# Altium schematic sheet Sheet1.schdoc
size A2; SheetNumber: 8; SheetTotal: 8
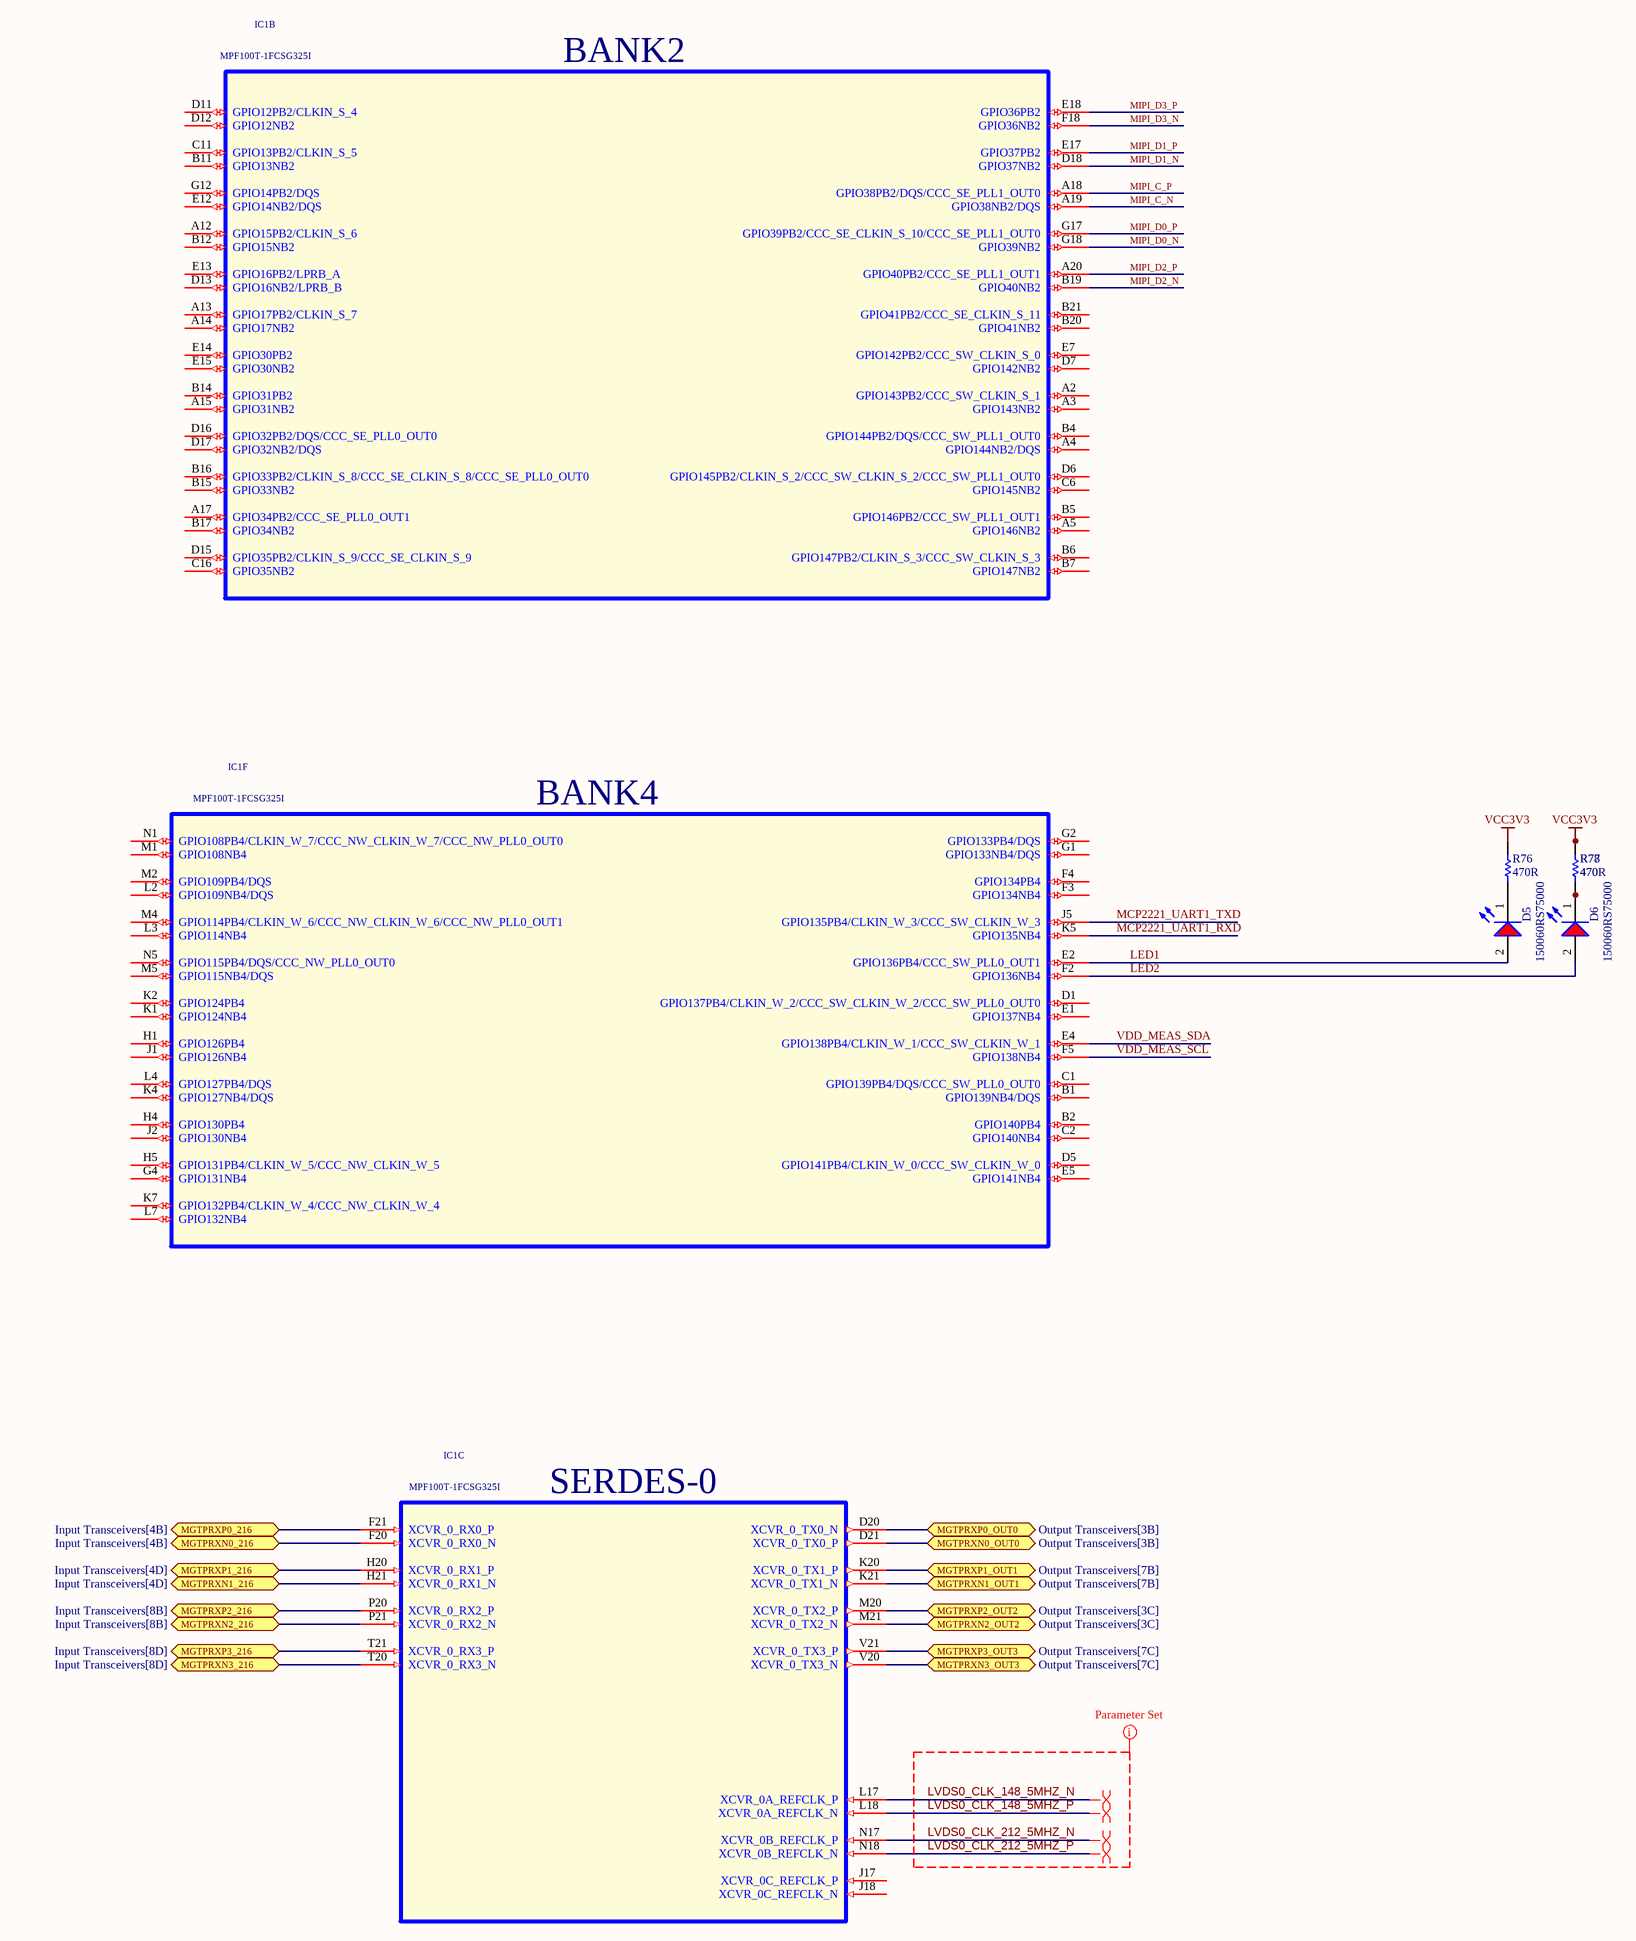
[diagram p0: Sheet1.schdoc]

## Parts
D5  150060RS75000  [WL-SMCW_0603_150060xx75000]
D6  150060RS75000  [WL-SMCW_0603_150060xx75000]
IC1  MPF100T-1FCSG325I  [MPF100T-1FCSG325I]  (parts B,C,F of 9)
R76  470R  [RESC1005X40X25ML05T10]
R77  470  [RESC1005X40X25ML05T10]
R78  470R  [RESC1005X40X25ML05T10]

## Ports
MGTPRXN0_216 (bidir, see Input Transceivers[4B]), MGTPRXN0_OUT0 (bidir, see Output Transceivers[3B]), MGTPRXN1_216 (bidir, see Input Transceivers[4D]), MGTPRXN1_OUT1 (bidir, see Output Transceivers[7B]), MGTPRXN2_216 (bidir, see Input Transceivers[8B]), MGTPRXN2_OUT2 (bidir, see Output Transceivers[3C]), MGTPRXN3_216 (bidir, see Input Transceivers[8D]), MGTPRXN3_OUT3 (bidir, see Output Transceivers[7C]), MGTPRXP0_216 (bidir, see Input Transceivers[4B]), MGTPRXP0_OUT0 (bidir, see Output Transceivers[3B]), MGTPRXP1_216 (bidir, see Input Transceivers[4D]), MGTPRXP1_OUT1 (bidir, see Output Transceivers[7B]), MGTPRXP2_216 (bidir, see Input Transceivers[8B]), MGTPRXP2_OUT2 (bidir, see Output Transceivers[3C]), MGTPRXP3_216 (bidir, see Input Transceivers[8D]), MGTPRXP3_OUT3 (bidir, see Output Transceivers[7C])

## Nets
VCC3V3: R76.2 R77.2 R78.2
LED1: D5.2(A) IC1.E2(GPIO136PB4/CCC_SW_PLL0_OUT1)
LED2: D6.2(A) IC1.F2(GPIO136NB4)
LVDS0_CLK_148_5MHZ_N: IC1.L17(XCVR_0A_REFCLK_P)
LVDS0_CLK_148_5MHZ_P: IC1.L18(XCVR_0A_REFCLK_N)
LVDS0_CLK_212_5MHZ_N: IC1.N17(XCVR_0B_REFCLK_P)
LVDS0_CLK_212_5MHZ_P: IC1.N18(XCVR_0B_REFCLK_N)
MCP2221_UART1_RXD: IC1.K5(GPIO135NB4)
MCP2221_UART1_TXD: IC1.J5(GPIO135PB4/CLKIN_W_3/CCC_SW_CLKIN_W_3)
MGTPRXN0_216: IC1.F20(XCVR_0_RX0_N) ; port MGTPRXN0_216
MGTPRXN0_OUT0: IC1.D21(XCVR_0_TX0_P) ; port MGTPRXN0_OUT0
MGTPRXN1_216: IC1.H21(XCVR_0_RX1_N) ; port MGTPRXN1_216
MGTPRXN1_OUT1: IC1.K21(XCVR_0_TX1_N) ; port MGTPRXN1_OUT1
MGTPRXN2_216: IC1.P21(XCVR_0_RX2_N) ; port MGTPRXN2_216
MGTPRXN2_OUT2: IC1.M21(XCVR_0_TX2_N) ; port MGTPRXN2_OUT2
MGTPRXN3_216: IC1.T20(XCVR_0_RX3_N) ; port MGTPRXN3_216
MGTPRXN3_OUT3: IC1.V20(XCVR_0_TX3_N) ; port MGTPRXN3_OUT3
MGTPRXP0_216: IC1.F21(XCVR_0_RX0_P) ; port MGTPRXP0_216
MGTPRXP0_OUT0: IC1.D20(XCVR_0_TX0_N) ; port MGTPRXP0_OUT0
MGTPRXP1_216: IC1.H20(XCVR_0_RX1_P) ; port MGTPRXP1_216
MGTPRXP1_OUT1: IC1.K20(XCVR_0_TX1_P) ; port MGTPRXP1_OUT1
MGTPRXP2_216: IC1.P20(XCVR_0_RX2_P) ; port MGTPRXP2_216
MGTPRXP2_OUT2: IC1.M20(XCVR_0_TX2_P) ; port MGTPRXP2_OUT2
MGTPRXP3_216: IC1.T21(XCVR_0_RX3_P) ; port MGTPRXP3_216
MGTPRXP3_OUT3: IC1.V21(XCVR_0_TX3_P) ; port MGTPRXP3_OUT3
MIPI_C_N: IC1.A19(GPIO38NB2/DQS)
MIPI_C_P: IC1.A18(GPIO38PB2/DQS/CCC_SE_PLL1_OUT0)
MIPI_D0_N: IC1.G18(GPIO39NB2)
MIPI_D0_P: IC1.G17(GPIO39PB2/CCC_SE_CLKIN_S_10/CCC_SE_PLL1_OUT0)
MIPI_D1_N: IC1.D18(GPIO37NB2)
MIPI_D1_P: IC1.E17(GPIO37PB2)
MIPI_D2_N: IC1.B19(GPIO40NB2)
MIPI_D2_P: IC1.A20(GPIO40PB2/CCC_SE_PLL1_OUT1)
MIPI_D3_N: IC1.F18(GPIO36NB2)
MIPI_D3_P: IC1.E18(GPIO36PB2)
VDD_MEAS_SCL: IC1.F5(GPIO138NB4)
VDD_MEAS_SDA: IC1.E4(GPIO138PB4/CLKIN_W_1/CCC_SW_CLKIN_W_1)
NetD5_1: D5.1(K) R76.1
NetD6_1: D6.1(K) R77.1 R78.1

Not connected (* = marked no-connect by the designer): IC1 A2(GPIO143PB2/CCC_SW_CLKIN_S_1) A3(GPIO143NB2) A4(GPIO144NB2/DQS) A5(GPIO146NB2) A12(GPIO15PB2/CLKIN_S_6) A13(GPIO17PB2/CLKIN_S_7) A14(GPIO17NB2) A15(GPIO31NB2) A17(GPIO34PB2/CCC_SE_PLL0_OUT1) B1(GPIO139NB4/DQS) B2(GPIO140PB4) B4(GPIO144PB2/DQS/CCC_SW_PLL1_OUT0) B5(GPIO146PB2/CCC_SW_PLL1_OUT1) B6(GPIO147PB2/CLKIN_S_3/CCC_SW_CLKIN_S_3) B7(GPIO147NB2) B11(GPIO13NB2) B12(GPIO15NB2) B14(GPIO31PB2) B15(GPIO33NB2) B16(GPIO33PB2/CLKIN_S_8/CCC_SE_CLKIN_S_8/CCC_SE_PLL0_OUT0) B17(GPIO34NB2) B20(GPIO41NB2) B21(GPIO41PB2/CCC_SE_CLKIN_S_11) C1(GPIO139PB4/DQS/CCC_SW_PLL0_OUT0) C2(GPIO140NB4) C6(GPIO145NB2) C11(GPIO13PB2/CLKIN_S_5) C16(GPIO35NB2) D1(GPIO137PB4/CLKIN_W_2/CCC_SW_CLKIN_W_2/CCC_SW_PLL0_OUT0) D5(GPIO141PB4/CLKIN_W_0/CCC_SW_CLKIN_W_0) D6(GPIO145PB2/CLKIN_S_2/CCC_SW_CLKIN_S_2/CCC_SW_PLL1_OUT0) D7(GPIO142NB2) D11(GPIO12PB2/CLKIN_S_4) D12(GPIO12NB2) D13(GPIO16NB2/LPRB_B) D15(GPIO35PB2/CLKIN_S_9/CCC_SE_CLKIN_S_9) D16(GPIO32PB2/DQS/CCC_SE_PLL0_OUT0) D17(GPIO32NB2/DQS) E1(GPIO137NB4) E5(GPIO141NB4) E7(GPIO142PB2/CCC_SW_CLKIN_S_0) E12(GPIO14NB2/DQS) E13(GPIO16PB2/LPRB_A) E14(GPIO30PB2) E15(GPIO30NB2) F3(GPIO134NB4) F4(GPIO134PB4) G1(GPIO133NB4/DQS) G2(GPIO133PB4/DQS) G4(GPIO131NB4) G12(GPIO14PB2/DQS) H1(GPIO126PB4) H4(GPIO130PB4) H5(GPIO131PB4/CLKIN_W_5/CCC_NW_CLKIN_W_5) J1(GPIO126NB4) J2(GPIO130NB4) J17(XCVR_0C_REFCLK_P) J18(XCVR_0C_REFCLK_N) K1(GPIO124NB4) K2(GPIO124PB4) K4(GPIO127NB4/DQS) K7(GPIO132PB4/CLKIN_W_4/CCC_NW_CLKIN_W_4) L2(GPIO109NB4/DQS) L3(GPIO114NB4) L4(GPIO127PB4/DQS) L7(GPIO132NB4) M1(GPIO108NB4) M2(GPIO109PB4/DQS) M4(GPIO114PB4/CLKIN_W_6/CCC_NW_CLKIN_W_6/CCC_NW_PLL0_OUT1) M5(GPIO115NB4/DQS) N1(GPIO108PB4/CLKIN_W_7/CCC_NW_CLKIN_W_7/CCC_NW_PLL0_OUT0) N5(GPIO115PB4/DQS/CCC_NW_PLL0_OUT0)

## Layout directives
differential pair: LVDS0_CLK_148_5MHZ_N, LVDS0_CLK_148_5MHZ_P, LVDS0_CLK_212_5MHZ_N, LVDS0_CLK_212_5MHZ_P

## Notes on the sheet
- (in symbol MPF100T-1FCSG325I, part B) BANK2
- (in symbol MPF100T-1FCSG325I, part C) SERDES-0
- (in symbol MPF100T-1FCSG325I, part F) BANK4

## Library data of the parts
D5 D6 = CMP-1426-00001-4: LED Low-Power Uni-Color Red 630nm 2V 2-Pin Chip 0603(1608Metric) T/R; Max Junction Temperature (Tj): 95°C; Dominant Wavelength: 625nm; Lens Style: Clear, Rectangular; Viewing Angle: 140°; Forward Current: 100mA; Max Reverse Voltage (DC): 5V; Luminous Intensity: 250mcd; Test Current: 20mA; Power Dissipation: 72mW; Max Operating Temperature: 85°C; Mount: Surface Mount; Height: 700µm; Packaging: Tape and Reel; REACH SVHC: Unknown; Case Code (Metric): 1608; Peak Wavelength: 630nm; Forward Voltage: 2V; Case/Package: 0603; Color: Red; RoHS: Compliant; Width: 800µm; Reverse Voltage: 5V; Min Operating Temperature: -40°C; Wavelength: 625nm; Case Code (Imperial): 0603; Length: 1.6mm
IC1 = MPF100T-1FCSG325I: Part_Number: J00001; Part_Name: Jumper; ID: 110; Mounting_Type: SMT; ComponentLink1Description: Datasheet
R76-R78 = CMP-2002-07697-1: Part Number: RC0402FR-07470RL; Manufacturer: Yageo / Phycomp